# Altium schematic sheet uControlador.SchDoc
size A4
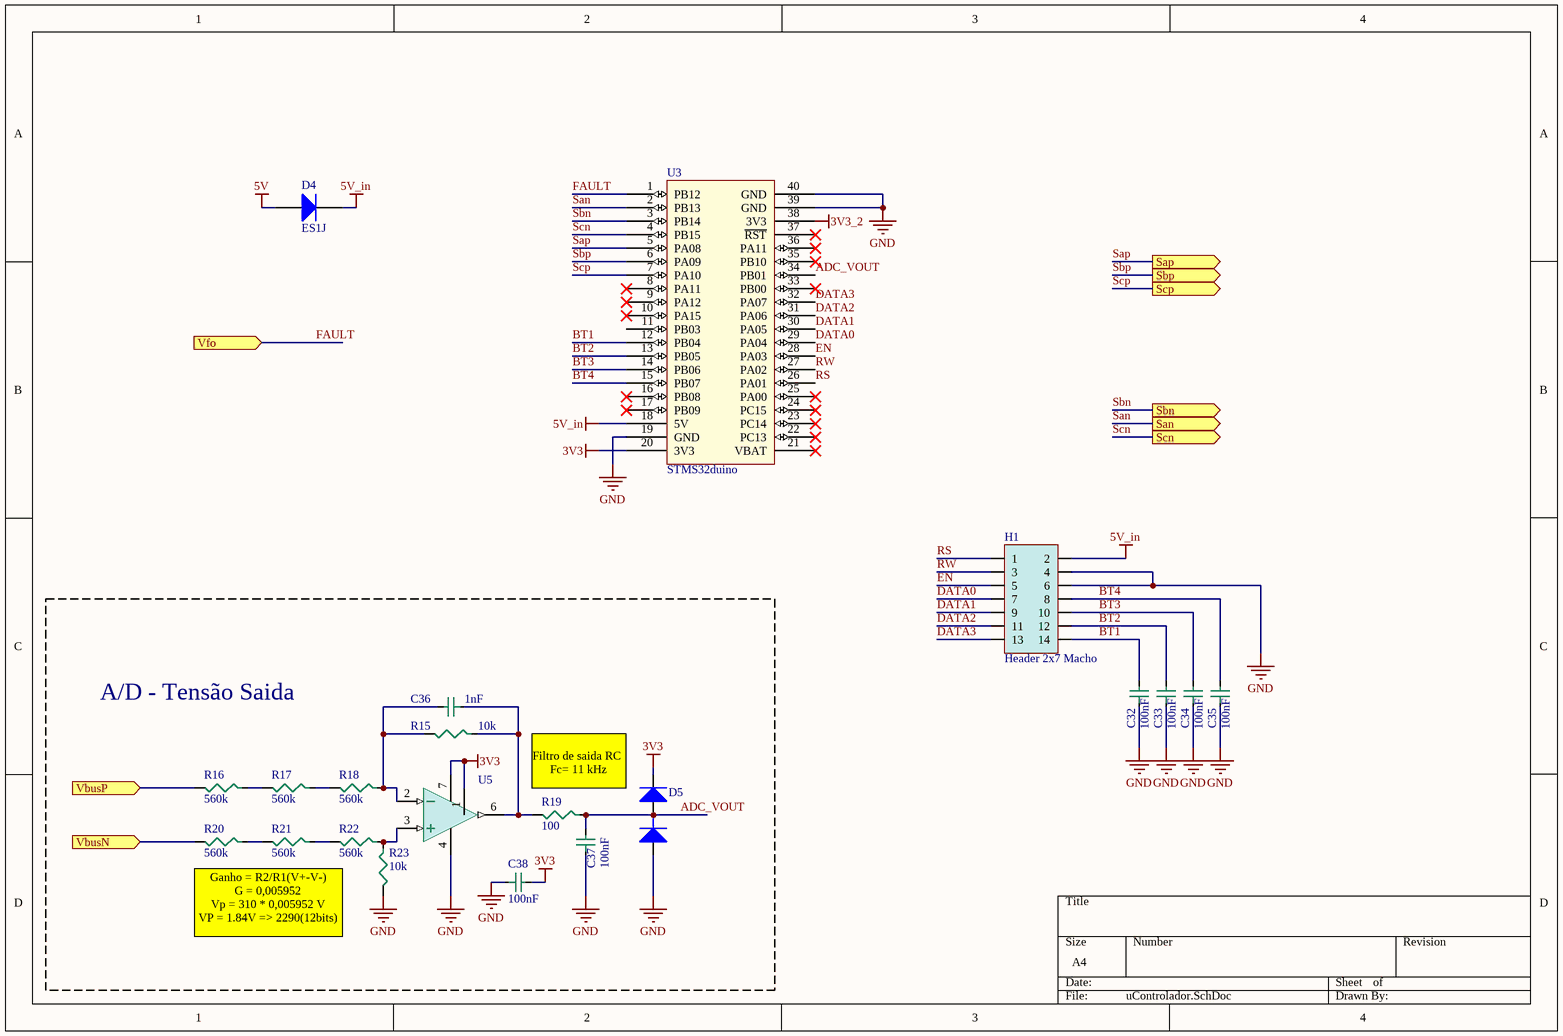
[diagram p0: uControlador.SchDoc]

## Parts
C32  value 100nF  [0805C]  (hidden comment: 0805)
C33  value 100nF  [0805C]  (hidden comment: 0805)
C34  value 100nF  [0805C]  (hidden comment: 0805)
C35  value 100nF  [0805C]  (hidden comment: 0805)
C36  value 1nF  [0805C]  (hidden comment: 0805)
C37  value 100nF  [0805C]  (hidden comment: 0805)
C38  value 100nF  [0805C]  (hidden comment: 0805)
D4  ES1J  [DO-214AC]
D5  Diode BAT54S  [SOT23-3N]  (value not drawn)
H1  Header 2x7 Macho  [HEADER 2X7]
R15  value 10k  [0805]  (hidden comment: 0805)
R16  value 560k  [0805]  (hidden comment: 0805)
R17  value 560k  [0805]  (hidden comment: 0805)
R18  value 560k  [0805]  (hidden comment: 0805)
R19  value 100  [0805]  (hidden comment: 0805)
R20  value 560k  [0805]  (hidden comment: 0805)
R21  value 560k  [0805]  (hidden comment: 0805)
R22  value 560k  [0805]  (hidden comment: 0805)
R23  value 10k  [0805]  (hidden comment: 0805)
U3  STMS32duino  [STM32duino]
U5  MAX4238  [LF351 SOIC 8]  (value not drawn)

## Blocks framed on the sheet
A/D - Tensão Saida: C36-C38 D5 R15-R23 U5

## Ports
San (out), Sap (out), Sbn (out), Sbp (out), Scn (out), Scp (out), VbusN (in), VbusP (in), Vfo (in)

## Nets
3V3: C38.2 D5.2(K) U3.20(3V3) U5.7
3V3_2: U3.38(3V3)
5V: D4.1(A)
5V_in: D4.2(K) H1.2 U3.18(5V)
GND: C32.1 C33.1 C34.1 C35.1 C37.1 C38.1 D5.1(A) H1.4 H1.6 R23.2 U3.19(GND) U3.39(GND) U3.40(GND) U5.4
ADC_VOUT: C37.2 D5.3(C) R19.1 U3.34(PB01)
BT1: C32.2 H1.14 U3.12(PB04)
BT2: C33.2 H1.12 U3.13(PB05)
BT3: C34.2 H1.10 U3.14(PB06)
BT4: C35.2 H1.8 U3.15(PB07)
DATA0: H1.7 U3.29(PA04)
DATA1: H1.9 U3.30(PA05)
DATA2: H1.11 U3.31(PA06)
DATA3: H1.13 U3.32(PA07)
EN: H1.5 U3.28(PA03)
FAULT: U3.1(PB12) ; port Vfo
RS: H1.1 U3.26(PA01)
RW: H1.3 U3.27(PA02)
San: U3.2(PB13) ; port San
Sap: U3.5(PA08) ; port Sap
Sbn: U3.3(PB14) ; port Sbn
Sbp: U3.6(PA09) ; port Sbp
Scn: U3.4(PB15) ; port Scn
Scp: U3.7(PA10) ; port Scp
VbusN: R20.2 ; port VbusN
VbusP: R16.2 ; port VbusP
NetC36_1: C36.1 R15.1 R19.2 U5.6
NetC36_2: C36.2 R15.2 R18.1 U5.2
NetR16_1: R16.1 R17.2
NetR17_1: R17.1 R18.2
NetR20_1: R20.1 R21.2
NetR21_1: R21.1 R22.2
NetR22_1: R22.1 R23.1 U5.3

Not connected (* = marked no-connect by the designer): U3 8(PA11)* 9(PA12)* 10(PA15)* 11(PB03) 16(PB08)* 17(PB09)* 21(VBAT)* 22(PC13)* 23(PC14)* 24(PC15)* 25(PA00)* 33(PB00)* 35(PB10)* 36(PA11)* 37(~{RST})*; U5 1(Balance)

## Notes on the sheet
- Filtro de saida RC
  Fc= 11 kHz
- Ganho = R2/R1(V+-V-)
  G = 0,005952
  Vp = 310 * 0,005952 V
  VP = 1.84V => 2290(12bits)

## Library data of the parts
C32-C38 = Capacitor SMD 0805
D4 = Diode ES1J: Rectifiers 1.0 A Ultra Fast Recovery Rect; ComponentLink1Description: MOUSER; ComponentLink1URL: https://br.mouser.com/ProductDetail/512-ES1J; ComponentLink2Description: DATASHEET; ComponentLink2URL: https://br.mouser.com/datasheet/2/308/ES1J-D-1804952.pdf
D5 = BAT54S: Schottky Diodes & Rectifiers SOT23 0.2A 30V Schot tky Dblr; ComponentLink1Description: MOUSER; ComponentLink1URL: https://www.mouser.com/ProductDetail/Rectron/BAT54S?qs=7pEAo90IqNGRiqD7TkybWA%3D%3D; ComponentLink2Description: DATASHEET; ComponentLink2URL: https://www.mouser.com/datasheet/2/345/bat54_a__c__s_-1862106.pdf
R15-R23 = Resistor SMD 0805 1/8 W: %: ±1%; P: 1/8W
U5 = CI Ampop MAX4238: Precision Amplifiers Ultra-Low Offset/Drift, Low-Noise, Precision SOT23 Amplifiers; ComponentLink1Description: MOUSER; ComponentLink1URL: https://www.mouser.com/ProductDetail/Maxim-Integrated/MAX4238ASA%2bT?qs=1eQvB6Dk1vh8%2FaVmoGTf%2FQ%3D%3D; ComponentLink2Description: DATASHEET; ComponentLink2URL: https://www.mouser.com/datasheet/2/256/MAX4238-MAX4239-767304.pdf